# EAGLE design lightdimmer_pot (EAGLE 7.6.0)
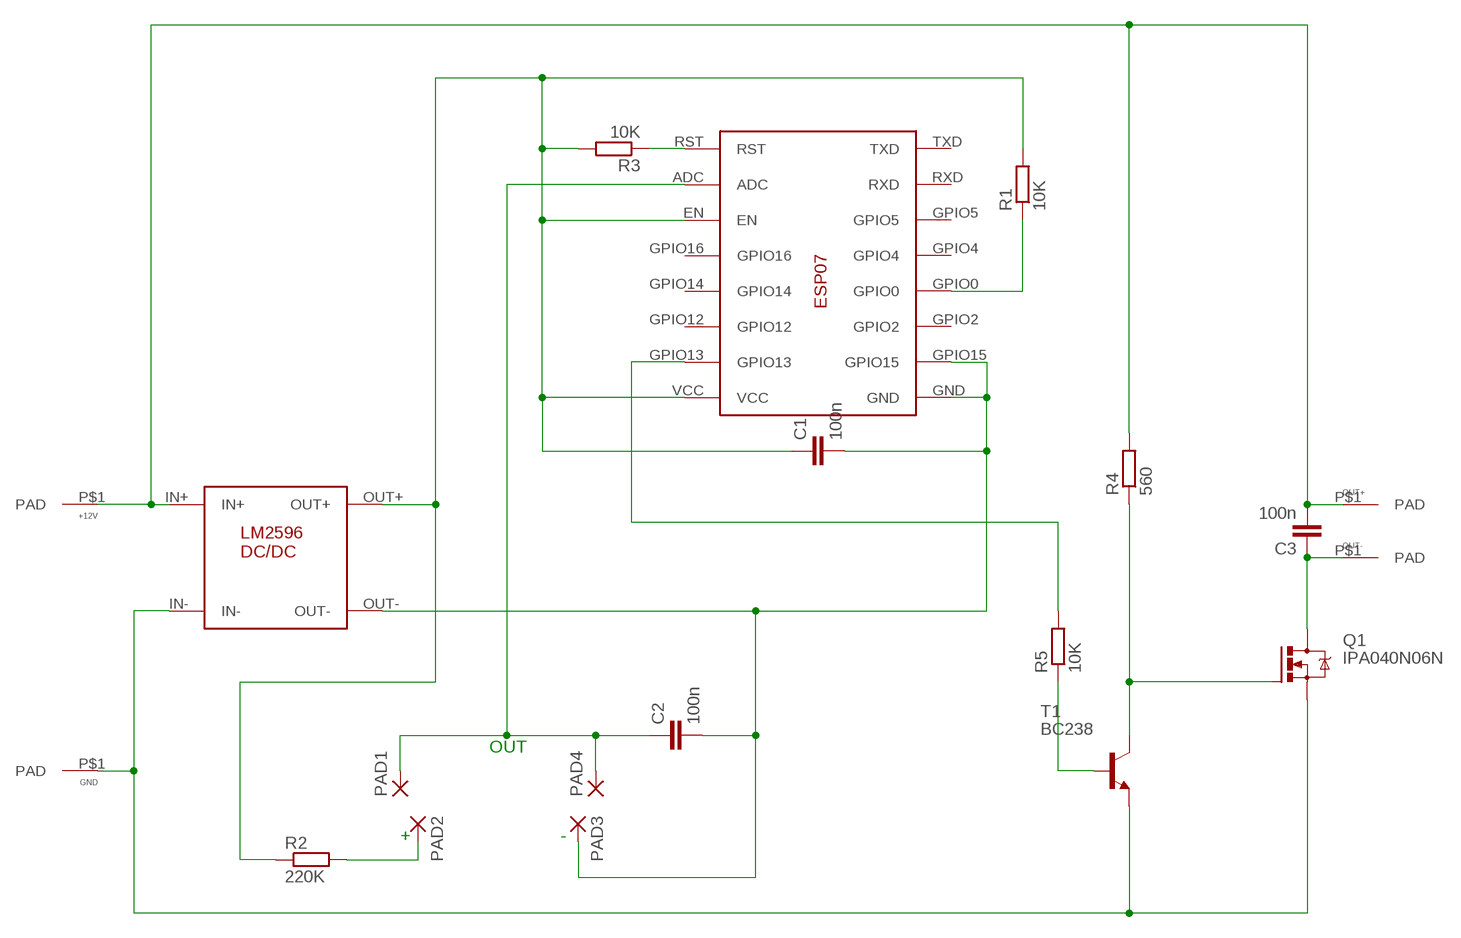
[diagram p0: schematic, sheet 1]

## Parts
+12V  PAD  [PAD]
C1  100n  C-EU050-025X075  [C050-025X075]
C2  100n  C-EU050-025X075  [C050-025X075]
C3  100n  C-EU050-025X075  [C050-025X075]
GND  PAD  [PAD]
OUT+  PAD  [PAD]
OUT-  PAD  [PAD]
PAD1  WIREPAD3,17/1,1  [3,17/1,1]
PAD2  WIREPAD3,17/1,1  [3,17/1,1]
PAD3  WIREPAD3,17/1,1  [3,17/1,1]
PAD4  WIREPAD3,17/1,1  [3,17/1,1]
Q1  IPA040N06N  IRF520  [TO220BV]
R1  10K  R-EU_0204/7  [0204/7]
R2  220K  R-EU_0204/7  [0204/7]
R3  10K  R-EU_0204/7  [0204/7]
R4  560  R-EU_0204/7  [0204/7]
R5  10K  R-EU_0204/7  [0204/7]
T1  BC238  BC238-NPN-TO92-CBE  [TO92-CBE]
U$1  LM2596DCDC  [LM2596DCDC]
U$2  ESP07  [ESP07]

## Nets
N$1: GND.P$1(PAD) Q1.S T1.E U$1.IN-
N$2: +12V.P$1(PAD) C3.2 OUT+.P$1(PAD) R4.2 U$1.IN+
N$3: C3.1 OUT-.P$1(PAD) Q1.D
N$4: C1.2 C2.2 PAD3.1(P) U$1.OUT- U$2.GND U$2.GPIO15
N$5: C1.1 R1.2 R2.1 R3.2 U$1.OUT+ U$2.EN U$2.VCC
N$6: R5.2 U$2.GPIO13
N$7: Q1.G R4.1 T1.C
N$8: C2.1 PAD1.1(P) PAD4.1(P) U$2.ADC
N$9: R1.1 U$2.GPIO0
N$10: R5.1 T1.B
N$11: PAD2.1(P) R2.2
N$13: R3.1 U$2.RST
Unconnected: U$2.GPIO2 U$2.GPIO4 U$2.GPIO5 U$2.GPIO12 U$2.GPIO14 U$2.GPIO16 U$2.RXD U$2.TXD

## Notes on the sheet
- OUT
- + | -

## Library data of the parts
+12V GND OUT+ OUT- = LEG-1A-5:PAD
C1-C3 = rcl:C-EU: CAPACITOR, European symbol
PAD1-PAD4 = wirepad:WIREPAD: Wire PAD connect wire on PCB
Q1 = transistor-power:IRF520: HEXFET Power MOSFET
R1-R5 = rcl:R-EU_: RESISTOR, European symbol
T1 = transistor:*-NPN-: NPN Transistror BF959 corrected 2008.03.06
U$1 = LM2596_DCDC:LM2596DCDC
U$2 = esp07adapter:ESP07

## Board
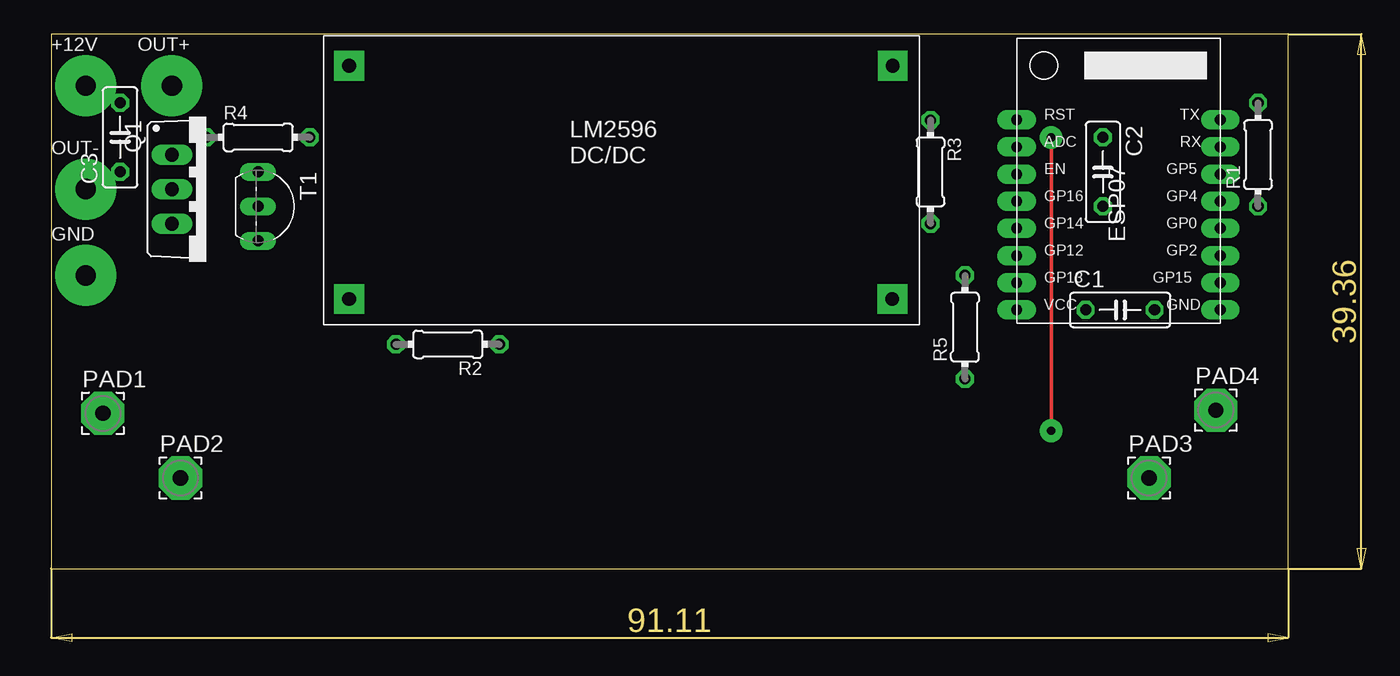
[diagram p1: board, top side]
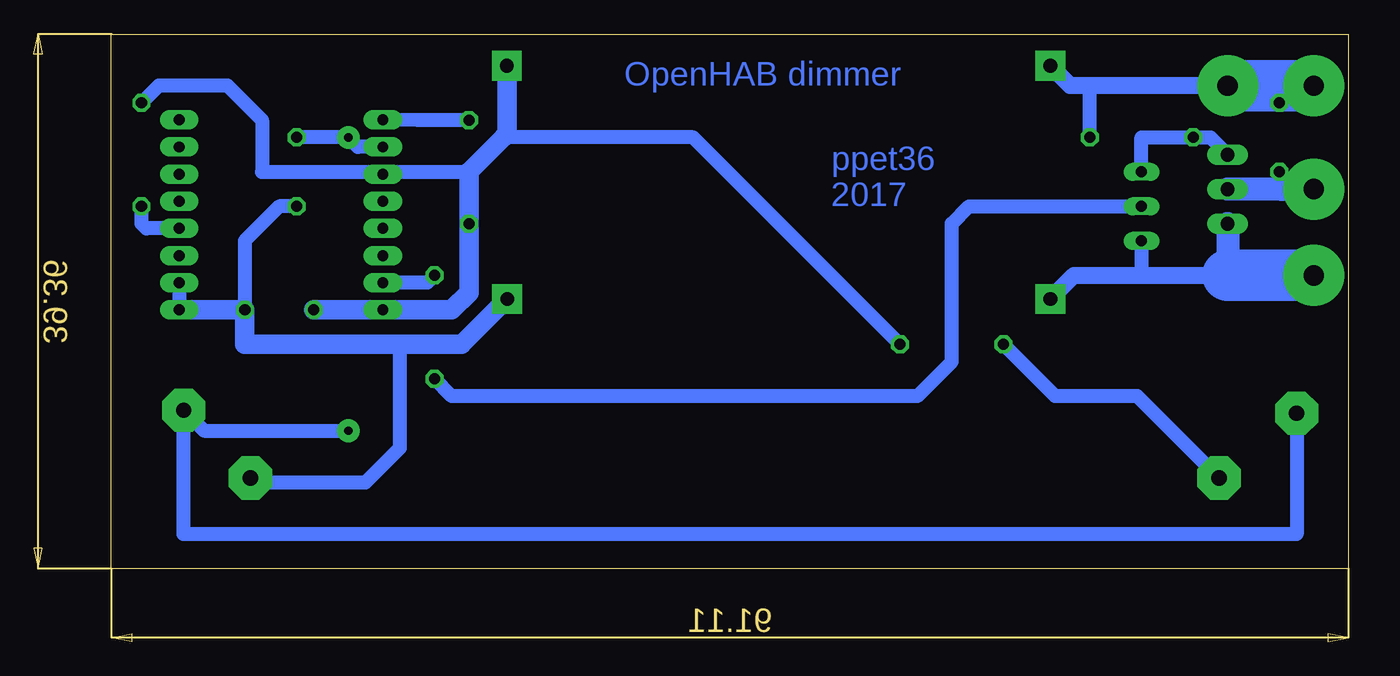
[diagram p2: board, bottom side, seen from below]

Size 91.11 x 39.36 mm. Coordinates in mm from the lower left corner, seen from the top.
Outline: 0,0 91.11,0 91.11,39.36 0,39.36 0,0
Copper layers (1*16): Top 0.035mm / dielectric 1.5mm / Bottom 0.035mm
Design rules "default": minimum track width 10mil, minimum drill 24mil, track to track 8mil, track to pad 8mil, pad to pad 8mil, via to via 8mil, smd to smd 8mil, copper to edge 40mil, drill to drill 8mil, minimum pad ring 10mil, minimum via ring 8mil, stop-mask expansion 4mil, vias tented up to drill 0mil, thermal gap 10mil

### Footprints (pad centres in the part's own frame; a part is rotated, then mirrored left to right if it is on the bottom)
PAD = drill 1.5 pad 4.5: P$1 0,0
C050-025X075 = drill 0.813 octagon: 1 -2.54,0; 2 2.54,0
3,17/1,1 = drill 1.118 pad 3.175 octagon: 1 0,0
TO220BV = drill 1.016 long: D 0,-2.54; G -2.54,-2.54; S 2.54,-2.54
0204/7 = drill 0.813 octagon: 1 -3.81,0; 2 3.81,0
TO92-CBE = drill 0.813 long: B 0,0; C -2.54,0; E 2.54,0
LM2596DCDC = drill 1 pad 2.184 square: IN+ -21.23,7.82; IN- -21.23,-9.355; OUT+ 18.805,7.82; OUT- 18.785,-9.355
ESP07 = drill 0.8 pad 1.422 long: ADC 0,12; EN 0,10; GND 15,0; GPIO0 15,6; GPIO2 15,4; GPIO4 15,8; GPIO5 15,10; GPIO12 0,4; GPIO13 0,2; GPIO14 0,6; GPIO15 15,2; GPIO16 0,8; RST 0,14; RXD 15,12; TXD 15,14; VCC 0,0

### Placement (x,y rotation side)
+12V  2.54,35.56 0 top
C1  78.74,19.05 0 top
C2  77.47,29.21 270 top
C3  5.08,31.75 90 top
GND  2.54,21.59 0 top
OUT+  8.89,35.56 0 top
OUT-  2.54,27.94 0 top
PAD1  3.81,11.43 0 top
PAD2  9.52,6.67 0 top
PAD3  80.87,6.67 0 top
PAD4  85.79,11.67 0 top
Q1  11.43,27.94 270 top
R1  88.9,30.48 90 top
R2  29.21,16.51 180 top
R3  64.77,29.21 270 top
R4  15.24,31.75 0 top
R5  67.31,17.78 90 top
T1  15.24,26.67 270 top
U$1  43.18,29.21 0 top
U$2  71.12,19.05 0 top

### Tracks (layer width: path | path; a pad name or v marks a point on that pad's centre or on a via)
N$1
  Bottom 1.016: T1.E 15.24,21.59
  Bottom 1.27: U$1.IN- 20.21,21.59 15.24,21.59 8.89,21.59
  Bottom 1.676: Q1.S 8.89,21.59
  Bottom 3.81: 8.89,21.59 GND.P$1
N$2
  Bottom 1.016: C3.2 5.08,35.56 | R4.2 19.05,35.56
  Bottom 1.27: OUT+.P$1 19.05,35.56 20.48,35.56 U$1.IN+
  Bottom 3.81: +12V.P$1 5.08,35.56 OUT+.P$1
N$3
  Bottom 1.016: C3.1 5.08,27.94
  Bottom 1.676: OUT-.P$1 5.08,27.94 Q1.D
N$4
  Bottom 1.016: U$2.GPIO15 U$2.GND | C2.2 78.74,26.67 81.28,24.13 C1.2 | PAD3.1 80.55,6.35 72.39,6.35 69.85,8.89 69.85,16.51
  Bottom 1.422: U$2.GND C1.2 81.28,16.51 69.85,16.51 65.31,16.51 U$1.OUT-
N$5
  Bottom 1.016: 64.77,29.21 70.96,29.21 U$2.EN 71.28,29.21 80.01,29.21 80.01,33.02 82.55,35.56 87.63,35.56 R1.2 | 61.98,32 62.23,31.75 48.26,31.75 R2.1
  Bottom 1.422: 62.23,31.75 64.77,29.21 R3.2 64.77,20.32 66.04,19.05 U$2.VCC C1.1 | 61.98,32 U$1.OUT+
N$6
  Bottom 1.016: R5.2 67.85,21.05 U$2.GPIO13
N$7
  Bottom 1.016: Q1.G 10.16,31.75 R4.1 15.24,31.75 T1.C
N$8  (via drill 0.6 pad 1.68)
  Top 0.254: v73.66,10.16 v73.66,31.75
  Bottom 1.016: PAD1.1 3.81,2.54 85.79,2.54 PAD4.1 84.28,10.16 v73.66,10.16 | U$2.ADC 72.96,31.05 v73.66,31.75 C2.1
N$9
  Bottom 1.016: U$2.GPIO0 88.55,25.05 88.9,25.4 R1.1
N$10
  Bottom 1.016: T1.B 27.94,26.67 29.21,25.4 29.21,15.24 31.75,12.7 66.04,12.7 R5.1
N$11
  Bottom 1.016: PAD2.1 15.55,12.7 21.59,12.7 R2.2
N$13
  Bottom 1.016: R3.1 68.55,33.02 U$2.RST

### Text on the board
Bottom: OpenHAB dimmer | ppet36 / 2017